# EAGLE design MLX90614 Break Board_SCH (EAGLE 9.6.2)
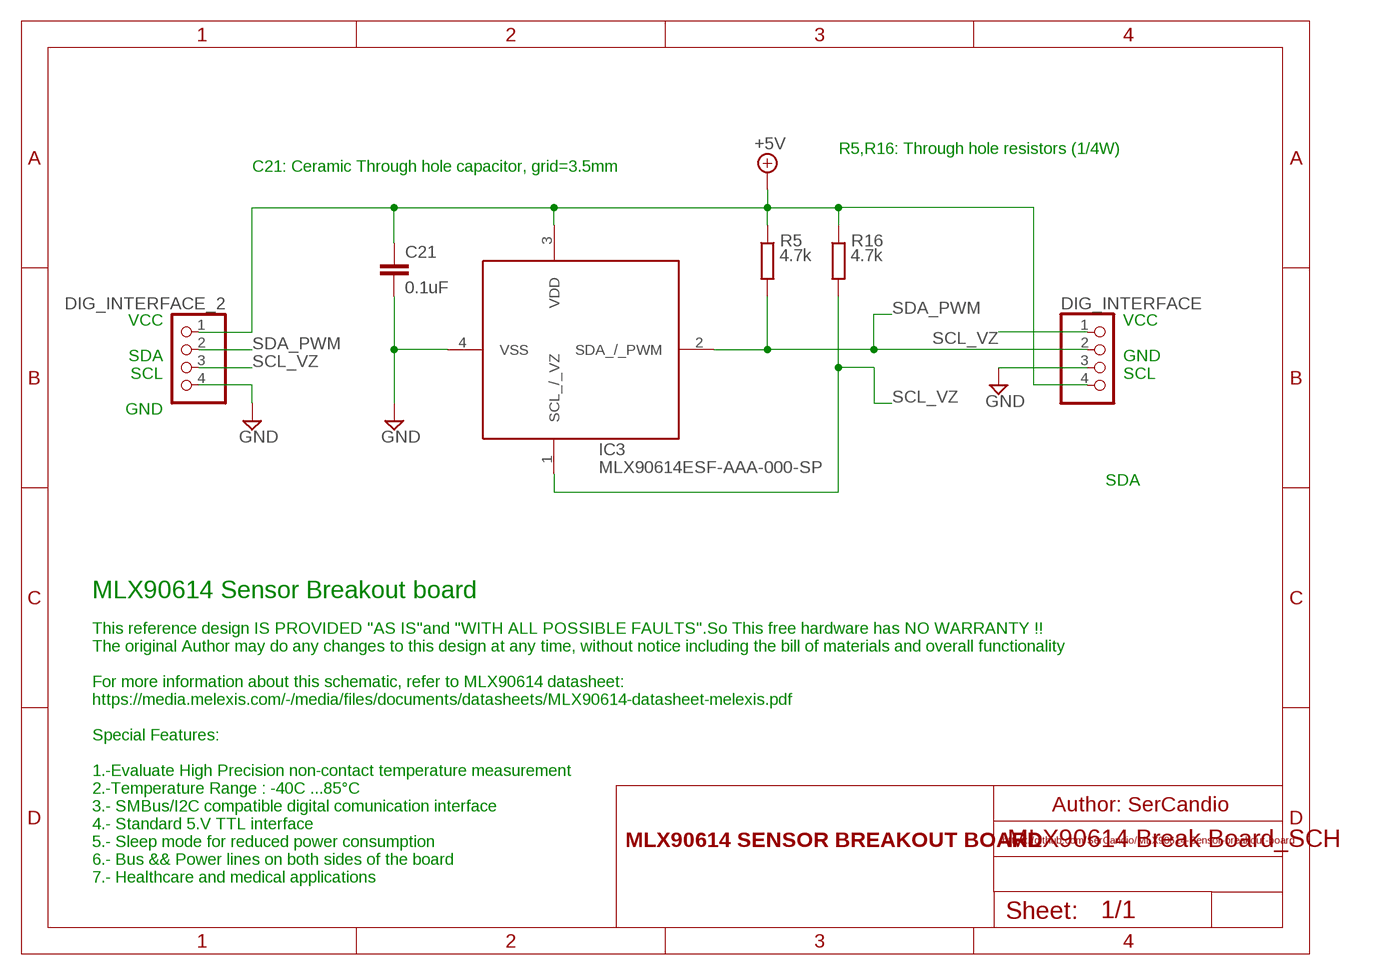
[diagram p0: schematic, sheet 1]

## Parts
C21  0.1uF  C-EU025-025X050  [C025-025X050]
DIG_INTERFACE  PINHD-1X4/90  [1X04/90]
DIG_INTERFACE_2  PINHD-1X4/90  [1X04/90]
IC3  MLX90614ESF-AAA-000-SP  [MLX90614ESFAAA000SP]
R5  4.7k  R-EU_0207/10  [0207/10]
R16  4.7k  R-EU_0207/10  [0207/10]

## Nets
+5V: C21.1 DIG_INTERFACE.4 DIG_INTERFACE_2.1 IC3.3(VDD) R5.1 R16.1
GND: C21.2 DIG_INTERFACE.3 DIG_INTERFACE_2.4 IC3.4(VSS)
SCL_VZ: DIG_INTERFACE.1 DIG_INTERFACE_2.3 IC3.1(SCL_/_VZ) R16.2
SDA_PWM: DIG_INTERFACE.2 DIG_INTERFACE_2.2 IC3.2(SDA_/_PWM) R5.2

## Notes on the sheet
- R5,R16: Through hole resistors (1/4W)
- C21: Ceramic Through hole capacitor, grid=3.5mm
- VCC | VCC
- SDA | GND
- SCL | SCL
- GND
- SDA
- MLX90614 Sensor Breakout board
- This reference design IS PROVIDED "AS IS"and "WITH ALL POSSIBLE FAULTS".So This free hardware has NO WARRANTY !!
- The original Author may do any changes to this design at any time, without notice including the bill of materials and overall functionality
- For more information about this schematic, refer to MLX90614 datasheet:
- https://media.melexis.com/-/media/files/documents/datasheets/MLX90614-datasheet-melexis.pdf
- Special Features:
- 1.-Evaluate High Precision non-contact temperature measurement
- 2.-Temperature Range : -40C ...85°C
- 3.- SMBus/I2C compatible digital comunication interface | Author: SerCandio
- 4.- Standard 5.V TTL interface
- https://github.com/SerCandio/MLX90614-Sensor-breakout-board
- 5.- Sleep mode for reduced power consumption | MLX90614 SENSOR BREAKOUT BOARD
- 6.- Bus && Power lines on both sides of the board
- 7.- Healthcare and medical applications

## Library data of the parts
C21 = rcl:C-EU: CAPACITOR, European symbol; SPICEPREFIX: C
DIG_INTERFACE DIG_INTERFACE_2 = pinhead:PINHD-1X4: PIN HEADER
IC3 = SamacSys_Parts:MLX90614ESF-AAA-000-SP: Board Mount Temperature Sensors single pixel, 5V, standard acc., 90deg FOV Source: Datasheet <https://www.melexis.com/-/media/files/documents/datasheets/mlx90614-datasheet-melexis.pdf>; DESCRIPTION: Board Mount Temperature Sensors single pixel, 5V, standard acc., 90deg FOV; HEIGHT: 4.25mm; MANUFACTURER_NAME: Melexis; MANUFACTURER_PART_NUMBER: MLX90614ESF-AAA-000-SP; MOUSER_PART_NUMBER: 482-90614ESFAAA000SP; MOUSER_PRICE-STOCK: https://www.mouser.co.uk/ProductDetail/Melexis/MLX90614ESF-AAA-000-SP?qs=KuGPmAKtFKXncrlJt6bCOw%3D%3D
R5 R16 = rcl:R-EU_: RESISTOR, European symbol; SPICEPREFIX: R

## Board
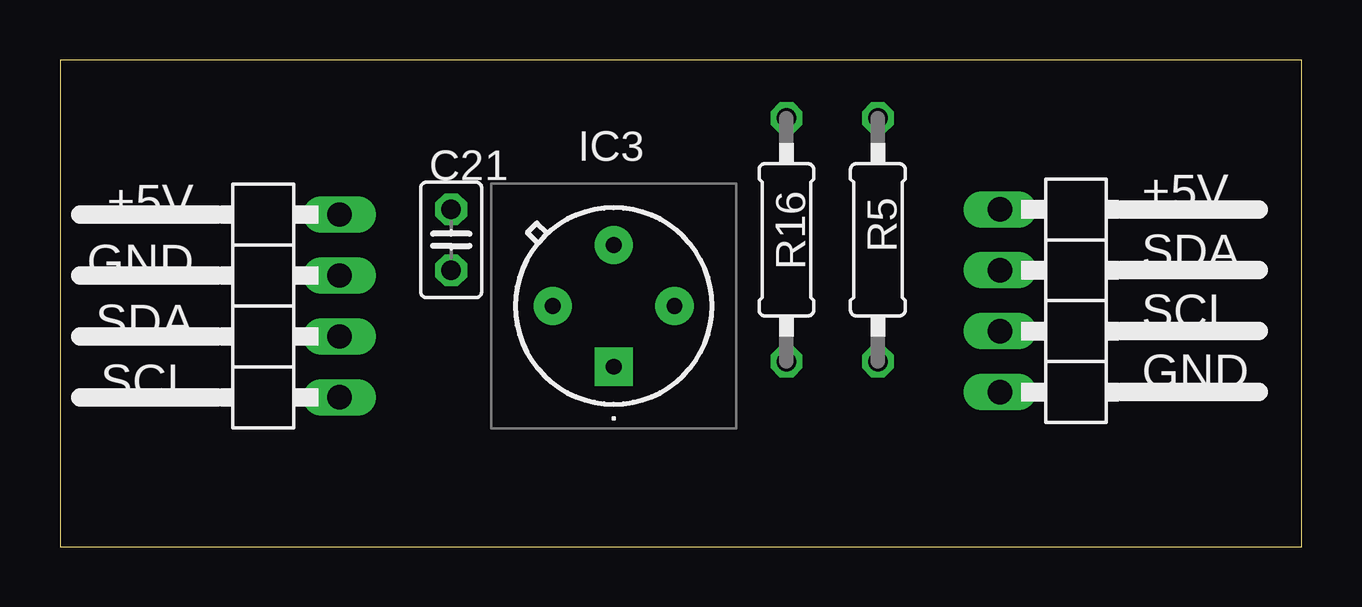
[diagram p1: board, top side]
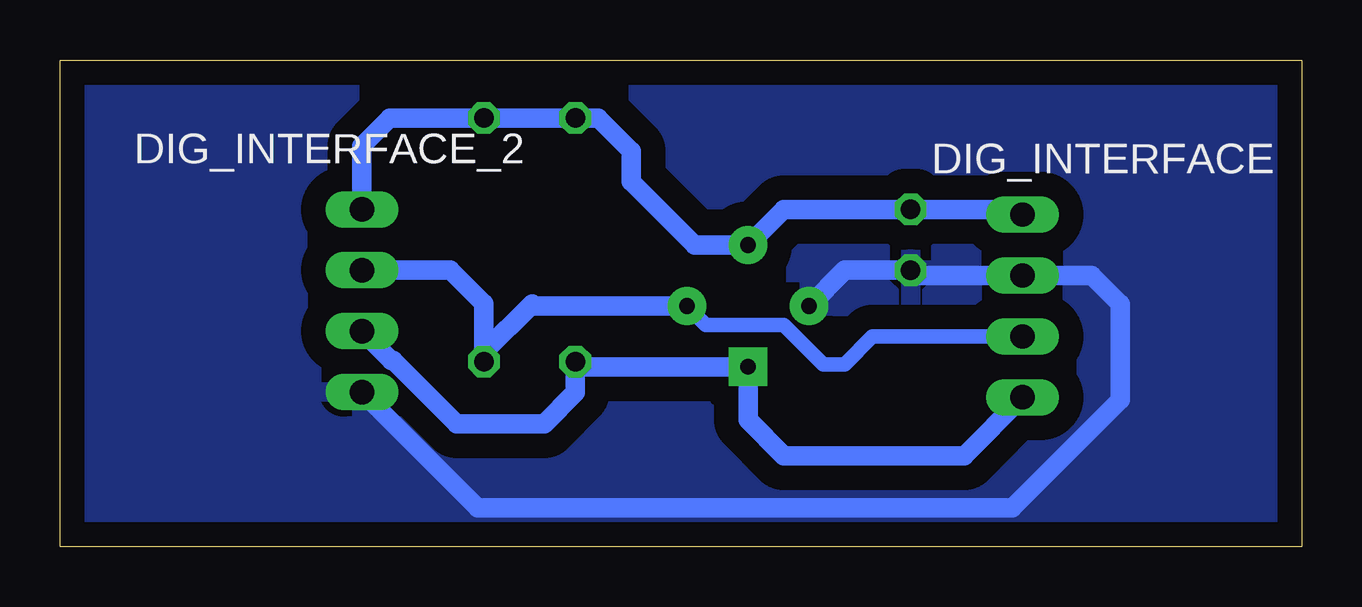
[diagram p2: board, bottom side, seen from below]

Size 51.74 x 20.31 mm. Coordinates in mm from the lower left corner, seen from the top.
Outline: 0,0 51.74,0 51.74,20.31 0,20.31 0,0
Copper layers (1*16): Top 0.035mm / dielectric 1.5mm / Bottom 0.035mm
Design rules "default": minimum track width 6mil, minimum drill 0.35mm, track to track 6mil, track to pad 6mil, pad to pad 6mil, via to via 6mil, smd to smd 6mil, copper to edge 40mil, drill to drill 6mil, minimum pad ring 10mil, minimum via ring 8mil, stop-mask expansion 4mil, vias tented up to drill 0mil, thermal gap 10mil

### Footprints (pad centres in the part's own frame; a part is rotated, then mirrored left to right if it is on the bottom)
C025-025X050 = drill 0.813 octagon: 1 -1.27,0; 2 1.27,0
1X04/90 = drill 1.016 long: 1 -3.81,-3.81; 2 -1.27,-3.81; 3 1.27,-3.81; 4 3.81,-3.81
MLX90614ESFAAA000SP = drill 0.65 pad 1.6 square: 1 0,0 | drill 0.65 pad 1.6: 2 2.54,-2.54; 3 5.08,0; 4 2.54,2.54
0207/10 = drill 0.813 octagon: 1 -5.08,0; 2 5.08,0

### Placement (x,y rotation side)
C21  16.3,12.81 270 top
DIG_INTERFACE  7.83,10.05 90 top
DIG_INTERFACE_2  42.97,10.27 270 top
IC3  23.07,7.51 90 top
R5  34.08,12.81 270 top
R16  30.27,12.81 270 top

### Tracks (layer width: path | path; a pad name or v marks a point on that pad's centre or on a via)
+5V
  Bottom 0.813: DIG_INTERFACE.4 11.86,14.08 C21.1 21.58,14.08 IC3.3 25.29,12.59 27.94,15.24 27.94,16.51 29.32,17.89 R16.1 R5.1 37.99,17.89 39.16,16.72 DIG_INTERFACE_2.1
GND
  Bottom 0.813: IC3.4 19.04,11.54 C21.2 16.08,11.32 DIG_INTERFACE.3 8.75,11.32 7.57,10.14 7.57,6.14 12.07,1.64 34.34,1.64 DIG_INTERFACE_2.4
  pour Bottom (isolate 1.016): 0,20.32 52.07,20.32 52.07,0 0,0
SCL_VZ
  Bottom 0.813: DIG_INTERFACE.1 14.07,3.81 21.59,3.81 23.07,5.29 IC3.1 30.05,7.51 R16.2 30.27,6.44 31.57,5.14 35.21,5.14 37.85,7.78 37.94,7.78 DIG_INTERFACE_2.3
SDA_PWM
  Bottom 0.61: DIG_INTERFACE.2 17.89,8.78 19.05,7.62 19.93,7.62 21.58,9.27 24.83,9.27 IC3.2
  Bottom 0.813: IC3.2 31.98,10.05 32.07,10.14 34.08,8.13 R5.2 34.08,10.15 35.47,11.54 DIG_INTERFACE_2.2

### Text on the board
tNames: +5V | +5V | GND | SDA | SDA | SCL | SCL | GND